# Altium schematic sheet DC Step-Down Converter.SchDoc
size A4; Organization: Machine Intelligence Laboratory; SheetNumber: 4; SheetTotal: 4; Des1: This steps down the ~22V; Des2: from the battery to 5V for use; Des3: with PCB electronics.; Author1: Russell MacGregor; VersionControl_Repository: BatteryMonitorSpring2025
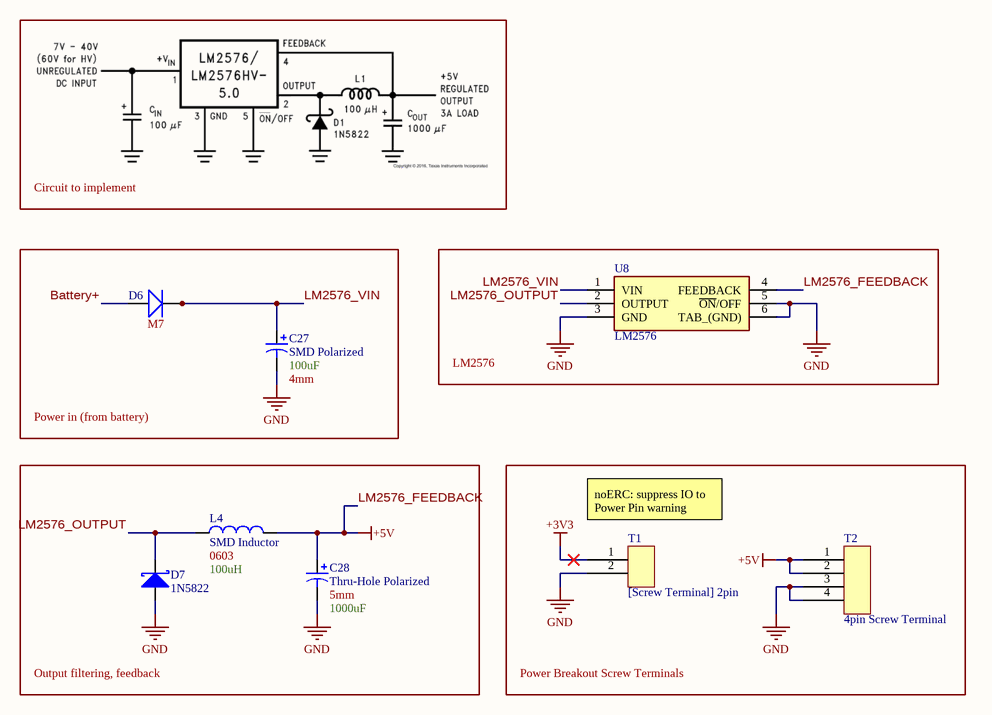
[diagram p0: DC Step-Down Converter.SchDoc]

## Parts
C27  SMD Polarized  Capacitance: 100uF  Diameter: 4mm  [[Cap] SMD Polarized, 4mm]
C28  Thru-Hole Polarized  Pin Spacing: 5mm  Capacitance: 1000uF  [[Cap] Thru-Hole Polarized 5mm]
D6  Size Package: M7  [[Diode] SMD M7]  (hidden comment: Rectifier)
D7  1N5822  [[Diode] Thru-Hole Schottky]
L4  SMD Inductor  Size Package: 0603  Inductance: 100uH  [[Inductor] SMD 0603]
T1  [Screw Terminal] 2pin  [[Screw Terminal] 2pin]
T2  4pin Screw Terminal  [[Screw Terminal] 4pin]
U8  LM2576  [[IC] Buck Converter]

## Blocks framed on the sheet
Power in (from battery): C27 D6
LM2576: U8
Output filtering, feedback: C28 D7 L4
Power Breakout Screw Terminals: T1 T2

## Nets
+3V3: T1.1
GND: C27.2 C28.2 D7.2(A) T1.2 T2.3 T2.4 U8.3(GND) U8.5(~{ON}/OFF) U8.6(TAB_(GND))
LM2576_FEEDBACK: C28.1 L4.2 T2.1 T2.2 U8.4(FEEDBACK)  [also labelled +5V]
Battery+: D6.2(Anode)
LM2576_OUTPUT: D7.1(K) L4.1 U8.2(OUTPUT)
LM2576_VIN: C27.1 D6.1(Cathode) U8.1(VIN)

## Notes on the sheet
- Circuit to implement
- (near T1) noERC: suppress IO to Power Pin warning
- Project/Vehicle:
- Author(s):
- -
- Revisor(s):
- Git Repo:
- Git Hash:
- Date:
- Revision:
- Size:
- A4
- File:
- Sheet
- of

## Library data of the parts
C27 = [Cap] SMD Polarized: JLC Part #: *; Mouser Part #: *
C28 = [Cap] Thru-Hole Polarized: JLC Part #: *; Mouser Part #: *
D6 = [Diode] SMD Rectifier: Generic; Mouser Part #: *
D7 = [Diode] Thru-Hole Schottky: Mouser Part #: 511-1N5822
L4 = [Inductor] SMD Inductor: JLC Part #: *; Mouser Part #: *
T2 = [Screw Terminal] 4pin
U8 = [IC] Buck Converter